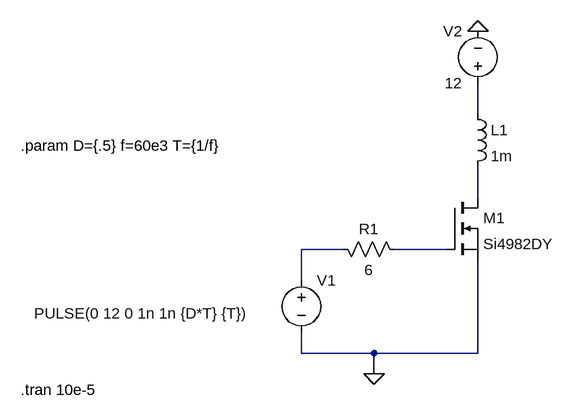
[diagram p0: schematic Algop.asc]
Algop.asc, the LTspice schematic file:
Version 4
SHEET 1 880 680
WIRE 352 -96 352 -144
WIRE 352 32 352 -16
WIRE 144 112 80 112
WIRE 304 112 224 112
WIRE 80 160 80 112
WIRE 80 272 80 240
WIRE 192 272 80 272
WIRE 352 272 352 128
WIRE 352 272 192 272
WIRE 192 304 192 272
FLAG 192 304 0
FLAG 352 -224 0
SYMBOL res 128 96 M90
WINDOW 0 0 56 VBottom 2
WINDOW 3 32 56 VTop 2
SYMATTR InstName R1
SYMATTR Value 6
SYMBOL voltage 80 144 R0
WINDOW 3 -411 67 Left 2
WINDOW 123 0 0 Left 0
WINDOW 39 0 0 Left 0
SYMATTR InstName V1
SYMATTR Value PULSE(0 12 0 1n 1n {D*T} {T})
SYMBOL nmos 304 32 R0
SYMATTR InstName M1
SYMATTR Value Si4982DY
SYMBOL ind 336 -112 R0
SYMATTR InstName L1
SYMATTR Value 1m
SYMBOL voltage 352 -128 R180
WINDOW 0 24 96 Left 2
WINDOW 3 24 16 Left 2
WINDOW 123 0 0 Left 0
WINDOW 39 0 0 Left 0
SYMATTR InstName V2
SYMATTR Value 12
TEXT -352 -48 Left 2 !.param D={.5} f=60e3 T={1/f}
TEXT -352 328 Left 2 !.tran 10e-5

The netlist it stands for:
* Algop.asc
R1 N003 N004 6
V1 N003 0 PULSE(0 12 0 1n 1n {D*T} {T})
M1 N002 N004 0 0 Si4982DY
L1 N001 N002 1m
V2 N001 0 12
.model NMOS NMOS
.model PMOS PMOS
.lib standard.mos
.param D={.5} f=60e3 T={1/f}
.tran 10e-5
.backanno
.end